# Altium schematic sheet Main_Schematic.SchDoc
size A4; Date: 1.06.2026; Author: Jan Rutkowski; CompanyName: KN_HARDWIRE; SheetNumber: 1; SheetTotal: 1
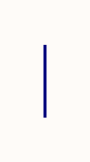
[diagram p0: Main_Schematic.SchDoc]

## Notes on the sheet
- Text
- Company Confidential / Not for distribution
- Project name:
- Document Name:
- Free Documents
- Sheet1.SchDoc
- Designer Name:
- Jan Rutkowski
- Date/Time:
- 10.03.26
- Revison:
- 1